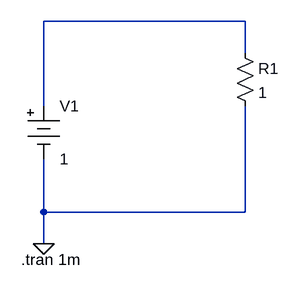
[diagram p0: schematic s-310_1.asc]
s-310_1.asc, the LTspice schematic file:
Version 4
SHEET 1 880 680
WIRE 496 240 192 240
WIRE 496 288 496 240
WIRE 192 368 192 240
WIRE 192 528 192 448
WIRE 496 528 496 368
WIRE 496 528 192 528
WIRE 192 576 192 528
FLAG 192 576 0
SYMBOL res 480 272 R0
SYMATTR InstName R1
SYMATTR Value 1
SYMBOL Misc\\battery 192 352 R0
WINDOW 123 0 0 Left 0
WINDOW 39 0 0 Left 0
SYMATTR InstName V1
SYMATTR Value 1
TEXT 158 600 Left 2 !.tran 1m

The netlist it stands for:
* s-310_1.asc
R1 N001 0 1
V1 N001 0 1
.tran 1m
.backanno
.end